# Altium schematic sheet TopLevel.SchDoc
size A4
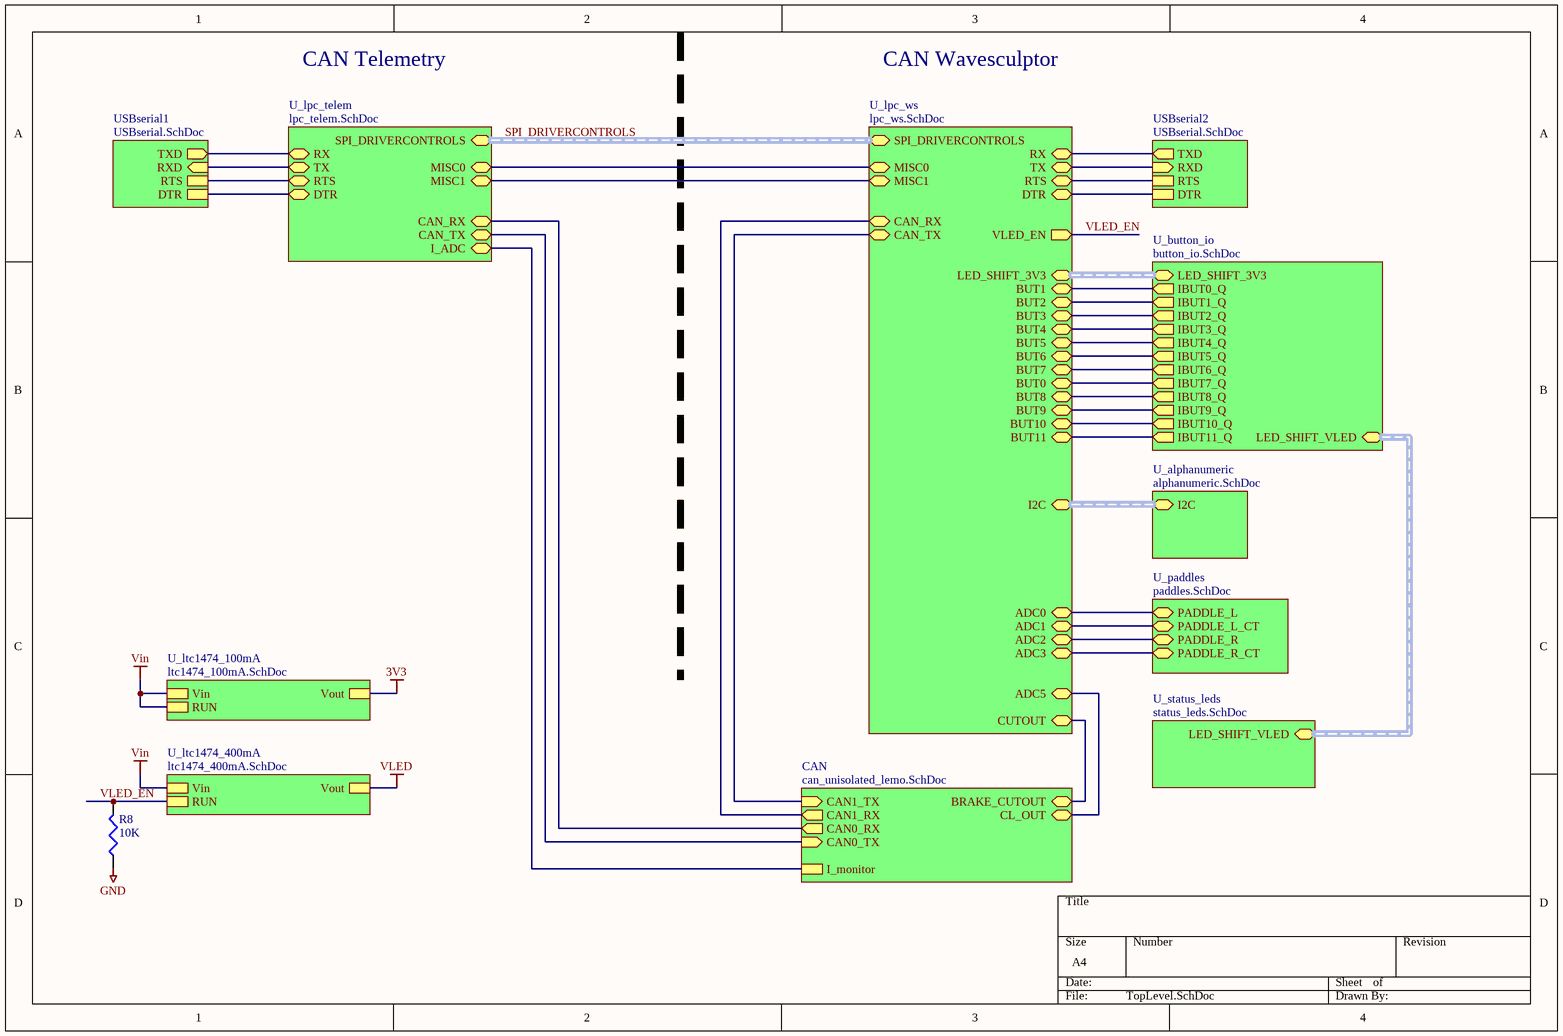
[diagram p0: TopLevel.SchDoc]

## Parts
R8  10K  [0603]

## Sub-sheets
CAN = can_unisolated_lemo.SchDoc: I_monitor, CAN0_TX (in), CAN0_RX (out), CAN1_TX (in), CAN1_RX (out), CL_OUT, BRAKE_CUTOUT
U_alphanumeric = alphanumeric.SchDoc: I2C (harness I2C)
U_button_io = button_io.SchDoc: LED_SHIFT_3V3 (harness LED_SHIFT), IBUT0_Q (out), IBUT1_Q (out), IBUT2_Q (out), IBUT3_Q (out), IBUT4_Q (out), IBUT5_Q (out), IBUT6_Q (out), IBUT7_Q (out), IBUT8_Q (out), IBUT9_Q (out), IBUT10_Q (out), IBUT11_Q (out), LED_SHIFT_VLED (harness LED_SHIFT_RET)
U_lpc_telem = lpc_telem.SchDoc: RX, TX, RTS, DTR, CAN_RX, CAN_TX, I_ADC, SPI_DRIVERCONTROLS (harness SPI), MISC0, MISC1
U_lpc_ws = lpc_ws.SchDoc: RX, TX, RTS, DTR, CAN_RX, CAN_TX, SPI_DRIVERCONTROLS (harness SPI), LED_SHIFT_3V3 (harness LED_SHIFT), VLED_EN (out), I2C (harness I2C), BUT1, BUT2, BUT3, BUT4, BUT5, BUT6, BUT7, BUT0, BUT8, BUT9, BUT10, BUT11, ADC0, ADC1, ADC2, ADC3, ADC5, CUTOUT, MISC0, MISC1
U_ltc1474_100mA = ltc1474_100mA.SchDoc: Vin, Vout, RUN
U_ltc1474_400mA = ltc1474_400mA.SchDoc: Vin, Vout, RUN
U_paddles = paddles.SchDoc: PADDLE_L, PADDLE_L_CT, PADDLE_R, PADDLE_R_CT
U_status_leds = status_leds.SchDoc: LED_SHIFT_VLED (harness LED_SHIFT_RET)
USBserial1 = USBserial.SchDoc: TXD (out), RXD (in), DTR, RTS
USBserial2 = USBserial.SchDoc: TXD (out), RXD (in), DTR, RTS

## Nets
3V3: sheet U_ltc1474_100mA/Vout
GND: R8.1
Vin: sheet U_ltc1474_100mA/Vin, sheet U_ltc1474_100mA/RUN, sheet U_ltc1474_400mA/Vin
VLED: sheet U_ltc1474_400mA/Vout
VLED_EN: R8.2 ; sheet U_lpc_ws/VLED_EN, sheet U_ltc1474_400mA/RUN
(unnamed): sheet CAN/I_monitor, sheet U_lpc_telem/I_ADC
(unnamed): sheet CAN/CAN0_TX, sheet U_lpc_telem/CAN_TX
(unnamed): sheet CAN/CAN0_RX, sheet U_lpc_telem/CAN_RX
(unnamed): sheet CAN/CAN1_TX, sheet U_lpc_ws/CAN_TX
(unnamed): sheet CAN/CAN1_RX, sheet U_lpc_ws/CAN_RX
(unnamed): sheet CAN/CL_OUT, sheet U_lpc_ws/ADC5
(unnamed): sheet CAN/BRAKE_CUTOUT, sheet U_lpc_ws/CUTOUT
(unnamed): sheet USBserial1/TXD, sheet U_lpc_telem/RX
(unnamed): sheet USBserial1/RXD, sheet U_lpc_telem/TX
(unnamed): sheet USBserial1/DTR, sheet U_lpc_telem/DTR
(unnamed): sheet USBserial1/RTS, sheet U_lpc_telem/RTS
(unnamed): sheet USBserial2/TXD, sheet U_lpc_ws/RX
(unnamed): sheet USBserial2/RXD, sheet U_lpc_ws/TX
(unnamed): sheet USBserial2/DTR, sheet U_lpc_ws/DTR
(unnamed): sheet USBserial2/RTS, sheet U_lpc_ws/RTS
(unnamed): sheet U_lpc_telem/MISC0, sheet U_lpc_ws/MISC0
(unnamed): sheet U_lpc_telem/MISC1, sheet U_lpc_ws/MISC1
(unnamed): sheet U_lpc_ws/BUT1, sheet U_button_io/IBUT0_Q
(unnamed): sheet U_lpc_ws/BUT2, sheet U_button_io/IBUT1_Q
(unnamed): sheet U_lpc_ws/BUT3, sheet U_button_io/IBUT2_Q
(unnamed): sheet U_lpc_ws/BUT4, sheet U_button_io/IBUT3_Q
(unnamed): sheet U_lpc_ws/BUT5, sheet U_button_io/IBUT4_Q
(unnamed): sheet U_lpc_ws/BUT6, sheet U_button_io/IBUT5_Q
(unnamed): sheet U_lpc_ws/BUT7, sheet U_button_io/IBUT6_Q
(unnamed): sheet U_lpc_ws/BUT0, sheet U_button_io/IBUT7_Q
(unnamed): sheet U_lpc_ws/BUT8, sheet U_button_io/IBUT8_Q
(unnamed): sheet U_lpc_ws/BUT9, sheet U_button_io/IBUT9_Q
(unnamed): sheet U_lpc_ws/BUT10, sheet U_button_io/IBUT10_Q
(unnamed): sheet U_lpc_ws/BUT11, sheet U_button_io/IBUT11_Q
(unnamed): sheet U_lpc_ws/ADC0, sheet U_paddles/PADDLE_L
(unnamed): sheet U_lpc_ws/ADC1, sheet U_paddles/PADDLE_L_CT
(unnamed): sheet U_lpc_ws/ADC2, sheet U_paddles/PADDLE_R
(unnamed): sheet U_lpc_ws/ADC3, sheet U_paddles/PADDLE_R_CT

## Buses and harness runs
harness sheet U_alphanumeric/I2C = sheet U_lpc_ws/I2C
harness sheet U_button_io/LED_SHIFT_3V3 = sheet U_lpc_ws/LED_SHIFT_3V3
harness sheet U_button_io/LED_SHIFT_VLED = sheet U_status_leds/LED_SHIFT_VLED
harness SPI_DRIVERCONTROLS = sheet U_lpc_telem/SPI_DRIVERCONTROLS = sheet U_lpc_ws/SPI_DRIVERCONTROLS

## Notes on the sheet
- CAN Telemetry
- CAN Wavesculptor

## Library data of the parts
R8 = RES1: Resistor; Value: 1k; Needed?: NO - HW LAB